# EasyEDA Pro project MFU.eprj, board HUB_ESP
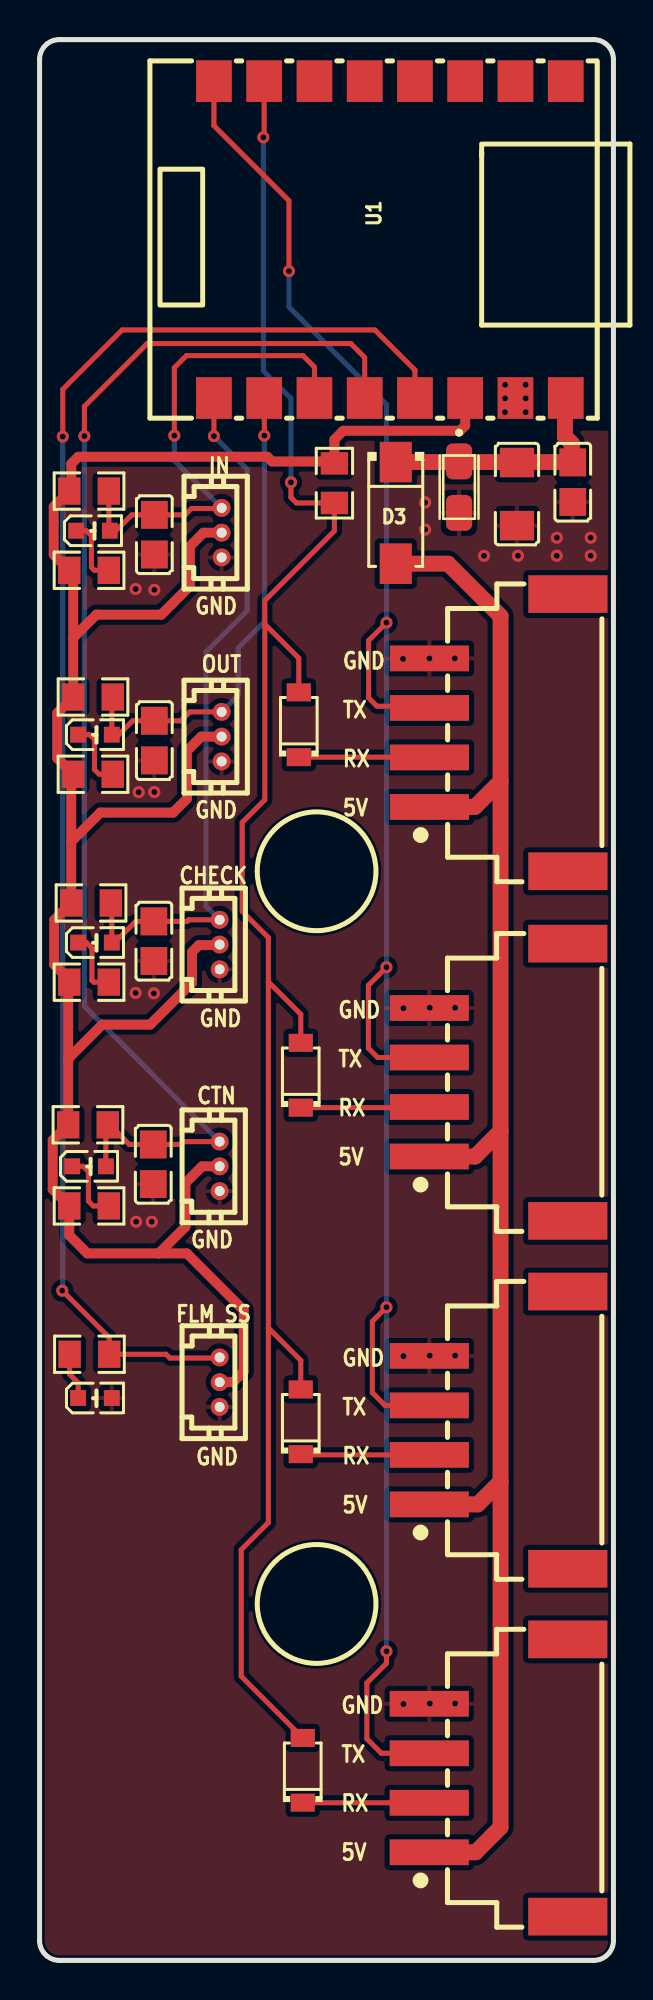
[diagram p7: board, top side]
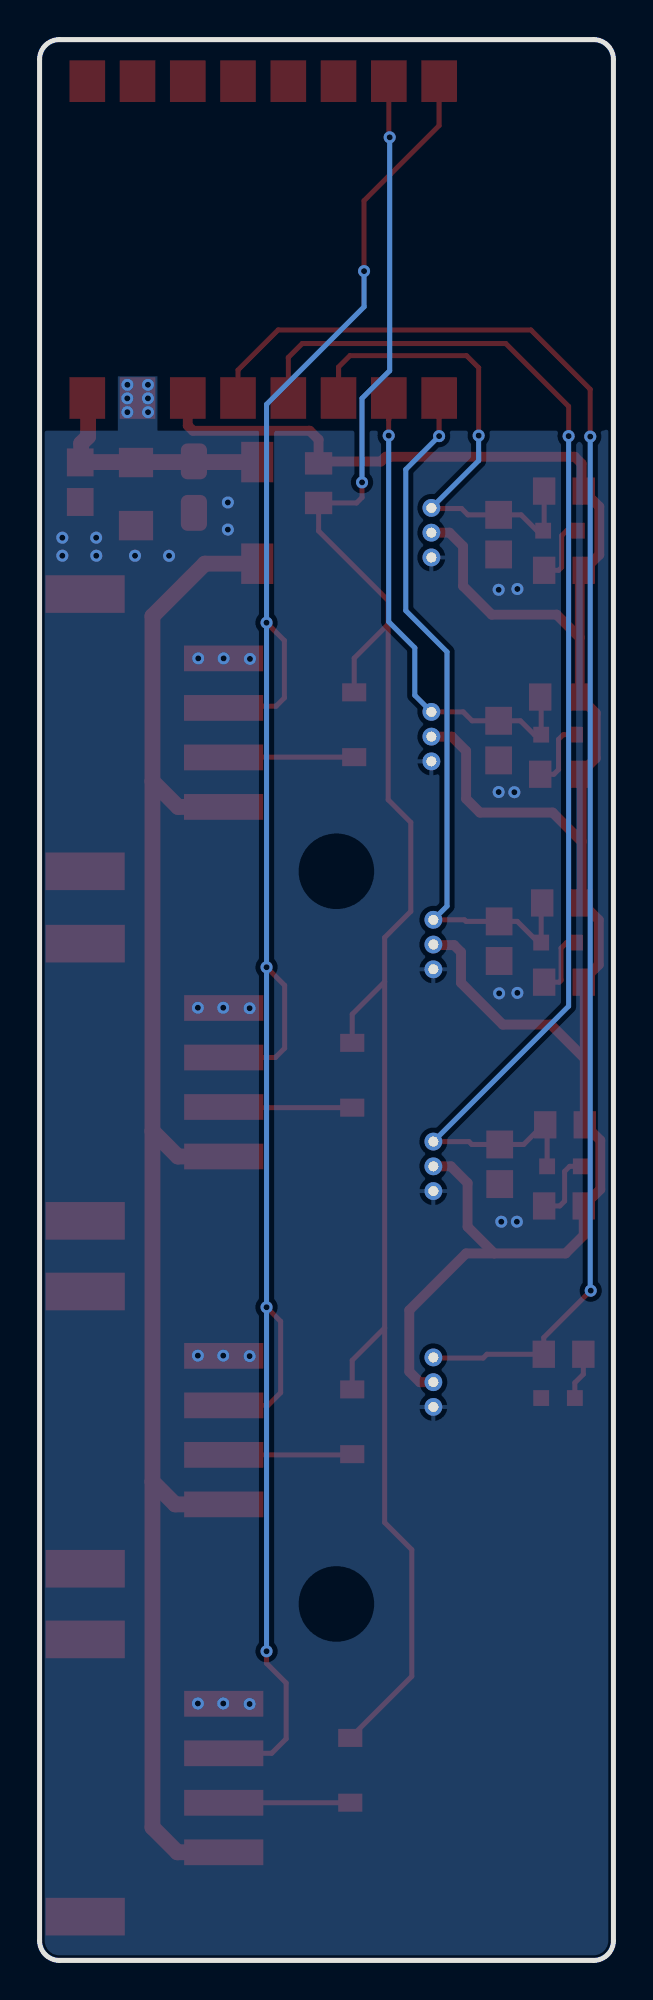
[diagram p8: board, bottom side, seen from below]

Outline 29 x 97 mm; copper layers: Top Layer, Bottom Layer. Coordinates in mm from the lower left corner of the outline.
Outline path: 0,96 arc(0.29,96.71) 1,97 28,97 arc(28.71,96.71) 29,96 29,1 arc(28.71,0.29) 28,0 1,0 arc(0.29,0.29) 0,1 0,96
Stack: Top Layer 0.035mm / Dielectric1 1.51mm FR4 er 4.5 / Bottom Layer 0.035mm

## Design rules (mm)
template: Custom Config
spacing copperThickness1oz (default): track to track 0.102, other pairs 0.152 to 0.3
spacing copperThickness2oz: track to track 0.203, other pairs 0.152 to 0.3
track width copperThickness1oz (default): min 0.127, default 0.254, max 2.54
track width copperThickness2oz: min 0.203, default 0.254, max 2.54
track width 5v: min 0.127, default 0.8, max 2.54
track width 3v3: min 0.127, default 0.5, max 2.54
differential pair differentialPair (default): width min 0.127, default 0.254, max 2.54; gap min 0.152, default 0.152
via viaSize (default): diameter min 0.5, default 0.61, max 10; hole min 0.3, default 0.305, max 6.3
net 3V3 uses 3v3
net GND uses 5v
net 5V uses 5v
net VCC uses 5v

## Placement (name value [footprint] x y rotation side)
C11  0.1u  [C0805]  26.94 74.65 270 top
C15  1u  [C1206]  24.13 74.05 270 top
C16  0.1u  [C0805]  5.8 61.6 270 top
C17  0.1u  [C0805]  5.8 72 270 top
C18  0.1u  [C0805]  5.78 51.47 270 top
C19  0.1u  [C0805]  5.75 40.2 270 top
CN2  XH2.54-4P  [CONN-SMD_4P-P2.50-WT]  23.19 44.35 90 top
CN3  XH2.54-4P  [CONN-SMD_4P-P2.50-WT]  23.19 26.78 90 top
CN4  XH2.54-4P  [CONN-SMD_4P-P2.50-WT]  23.19 9.21 90 top
CN5  XH2.54-4P  [CONN-SMD_4P-P2.50-WT]  23.2 62 90 top
D3  SS34  [SMA_L4.4-W2.8-LS5.4-RD]  18 73.1 270 top
D5  BAT54GWJ-HXY  [SOD-123_L2.7-W1.6-LS3.7-RD]  13.2 44.7 90 top
D6  BAT54GWJ-HXY  [SOD-123_L2.7-W1.6-LS3.7-RD]  13.2 27.2 90 top
D7  BAT54GWJ-HXY  [SOD-123_L2.7-W1.6-LS3.7-RD]  13.3 9.6 90 top
D8  BAT54GWJ-HXY  [SOD-123_L2.7-W1.6-LS3.7-RD]  13.1 62.4 90 top
LED2  -  [LED0603-R-RD]  2.8 61.9 0 top
LED3  -  [LED0603-R-RD]  2.7 72.2 0 top
LED4  -  [LED0603-R-RD]  2.8 51.4 0 top
LED5  -  [LED0603-R-RD]  2.5 40.1 0 top
LED6  -  [LED0603-R-RD]  2.8 28.4 0 top
R12  10k  [R0805]  2.7 59.9 180 top
R13  10k  [R0805]  2.7 63.8 180 top
R14  10k  [R0805]  2.5 70.2 180 top
R15  10k  [R0805]  2.5 74.2 180 top
R16  10k  [R0805]  2.5 49.4 180 top
R17  10k  [R0805]  2.6 53.4 180 top
R18  10k  [R0805]  14.9 74.6 90 top
R19  10k  [R0805]  2.5 38.1 180 top
R20  10k  [R0805]  2.45 42.2 180 top
R21  330  [R0805]  2.52 30.61 0 top
U1  ESP32C3-SuperMini  [COMM-SMD_16P-L22.5-W18.0-P2.54-TL]  17.7 86.9 270 top
U6  电池端子3pin  [CONN-TH_3P-P1.25_C9900015739]  9.2 72.1 270 top
U7  电池端子3pin  [CONN-TH_3P-P1.25_C9900015739]  9.2 61.8 270 top
U8  电池端子3pin  [CONN-TH_3P-P1.25_C9900015739]  9.1 51.3 270 top
U18  TAJA106M010RNJ  [CAPMP3216X180N]  21.2 74.4 270 top
U19  电池端子3pin  [CONN-TH_3P-P1.25_C9900015739]  9.1 40.1 270 top
U20  电池端子3pin  [CONN-TH_3P-P1.25_C9900015739]  9.1 29.2 270 top

## Footprints (pads in the part's own frame, mm; a bottom-side part is the same pattern mirrored in y, then rotated)
C0805
  rect 1.41x1.35 smd: 1(-1,0) 2(1,0)
C1206
  rect 1.485x1.728 smd: 1(-1.593,0) 2(1.593,0)
CAPMP3216X180N
  rrect 1.81x1.32 smd: 1(-1.3,0) 2(1.3,0)
COMM-SMD_16P-L22.5-W18.0-P2.54-TL
  rect 2.102x1.802 smd: 1(-8.001,8.89) 2(-8.001,6.35) 3(-8.001,3.81) 4(-8.001,1.27) 5(-8.001,-1.27) 6(-8.001,-3.81) 7(-8.001,-6.35) 8(-8.001,-8.89) 9(8.001,-8.89) 10(8.001,-6.35) 11(8.001,-3.81) 12(8.001,-1.27) 13(8.001,1.27) 14(8.001,3.81) 15(8.001,6.35) 16(8.001,8.89)
CONN-SMD_4P-P2.50-WT
  rect 1.3x4 smd: 1(-3.75,3.5) 2(-1.25,3.5) 3(1.25,3.5) 4(3.751,3.5)
  rect 1.9x4 smd: 5(7,-3.5) 6(-7,-3.5)
CONN-TH_3P-P1.25_C9900015739
  round 0.9 hole 0.5: 1(-1.25,0) 2(0,0) 3(1.25,0)
LED0603-R-RD
  rect 0.8x0.8 smd: 1(0.851,0) 2(-0.851,0)
R0805
  rect 1.133x1.377 smd: 1(-1,0) 2(1,0)
SMA_L4.4-W2.8-LS5.4-RD
  rect 2.046x1.62 smd: 1(-2.566,0) 2(2.566,0)
SOD-123_L2.7-W1.6-LS3.7-RD
  rect 0.91x1.22 smd: 1(-1.635,0) 2(1.635,0)

## Nets
As in the schematic.

Pads without a net: CN2 5 6; CN3 5 6; CN4 5 6; CN5 5 6; U1 1 2 3 4 5 6

## Via types
v1: diameter 0.61, hole 0.305, Top Layer to Bottom Layer, 47 vias

## Routing (per net, layer and track width the routed paths; a pad name or vN(x,y) marks a point on that pad's centre or on a via; arc(x,y) is an arc through that point)
3V3: length 119
  Top Layer w0.5: U1.14 21.51,77.51 21.25,77.25 15.35,77.25 14.9,76.8 R18.2 14.81,75.69 11.75,75.69 11.51,75.93 1.96,75.93 1.6,75.58 1.6,74.3 R15.2 0.72,73.42 0.72,70.98 R14.2 1.7,70 1.7,66.79 ; 6.02,35.7 7.45,35.7 10.32,32.83 10.32,29.73 9.78,29.2 U20.2 ; 6.02,35.7 2.42,35.7 1.5,36.62 R19.2 0.66,38.94 0.66,41.42 R20.2 1.45,45.54 ; 6.02,35.7 7.37,37.05 7.37,39.26 8.21,40.1 U19.2 ; U7.2 8.17,61.8 7.45,61.08 7.45,58.66 6.75,57.97 3.07,57.97 1.6,56.49 ; U8.2 9.07,51.27 8.06,51.27 7.7,50.92 7.7,49.37 5.59,47.26 3.17,47.26 1.45,45.54 ; 1.6,56.49 1.6,59.8 R12.2 0.89,60.71 0.89,62.99 R13.2 1.7,66.79 ; 1.6,56.49 R17.2 0.74,52.54 0.74,50.28 1.5,49.52 R16.2 1.45,49.35 1.45,45.54 ; U6.2 8.28,72.1 7.6,71.41 7.6,69.41 6.15,67.96 2.87,67.96 1.7,66.79
5V: length 84
  Top Layer w0.8: CN3.1 22.15,23.03 23.3,24.18 ; 23.3,24.18 23.3,41.88 ; 23.3,24.18 23.3,6.72 22.03,5.46 CN4.1 ; 23.3,41.88 22.01,40.6 CN2.1 ; 23.3,41.88 23.3,59.55 ; CN5.1 22,58.25 23.3,59.55 ; 23.3,59.55 23.3,67.88 20.65,70.53 D3.2
GND:
  vias: v1(4.85,69.26) v1(4.85,48.86) v1(4.88,37.3) v1(5.01,58.99) v1(5.67,37.3) v1(5.8,69.22) v1(5.8,59) v1(5.78,48.84) v1(18.37,65.72) v1(18.39,48.08) v1(18.39,30.52) v1(18.39,12.95) v1(19.49,73.62) v1(19.49,72.26) v1(19.7,65.75) v1(19.72,48.11) v1(19.72,30.54) v1(19.72,12.97) v1(20.98,65.75) v1(21,48.11) v1(21,30.54) v1(21,12.97) v1(22.46,70.93) v1(23.52,79.57) v1(23.52,78.88) v1(23.52,78.19) v1(24.18,70.94) v1(24.56,79.57) v1(24.57,78.88) v1(24.56,78.19) v1(26.14,71.85) v1(26.13,70.94) v1(27.85,71.85) v1(27.85,70.94)
VCC: length 12.4
  Top Layer w0.8: U1.16 26.55,78.86 26.55,76.95 26.9,76.6 26.9,75.69 26.93,75.67 ; D3.1 26.93,75.67 ; 26.93,75.67 C11.1
CHECK: length 36.1
  Top Layer w0.254: R17.1 3.65,53.35 LED4.1 3.79,51.4 4.86,52.47 C18.1 7.45,52.47 7.53,52.55 U8.1 ; U1.9 v1(8.81,76.98)
  Bottom Layer w0.254: v1(8.81,76.98) 10.49,75.29 10.49,68.16 8.41,66.08 8.41,53.24 U8.1
CTN: length 66
  Top Layer w0.254: LED5.1 3.35,42.1 R20.1 3.54,42.2 4.53,41.2 C19.1 7.16,41.2 7.3,41.35 U19.1 ; U1.12 16.43,80.95 15.73,81.65 5.44,81.65 2.26,78.48 v1(2.26,76.98)
  Bottom Layer w0.254: U19.1 2.26,48.19 v1(2.26,76.98)
FLM_SS: length 76.7
  Top Layer w0.254: U1.13 18.97,80.31 16.95,82.34 4.17,82.34 1.17,79.34 v1(1.17,76.95) ; v1(1.15,33.82) 3.52,31.45 R21.2 6.39,30.61 6.58,30.42 9.07,30.42 U20.1
  Bottom Layer w0.254: v1(1.15,33.82) 1.17,33.85 v1(1.17,76.95)
IN: length 25.4
  Top Layer w0.254: R15.1 3.5,72.25 LED3.1 3.86,72.2 4.66,73 C17.1 7.35,73 7.67,73.32 9.17,73.32 U6.1 ; v1(6.81,77) 6.81,80.43 7.42,81.04 13.31,81.04 13.89,80.46 U1.11
  Bottom Layer w0.254: v1(6.81,77) 6.81,75.74 U6.1
OUT: length 24.7
  Top Layer w0.254: R13.1 3.65,63.75 LED2.1 4,61.9 4.7,62.6 C16.1 7.14,62.6 7.59,63.05 U7.1 ; v1(11.36,77) 11.36,77 11.36,77.82 11.35,77.83 U1.10
  Bottom Layer w0.254: v1(11.36,77) 11.36,67.6 10.04,66.28 10.04,63.89 U7.1
RX: length 102.3
  Top Layer w0.254: D5.2 13.2,47.78 11.56,49.42 ; 11.56,49.42 11.56,51.65 10.24,52.97 10.24,57.47 11.38,58.61 11.38,67.48 ; 11.56,49.42 11.56,31.94 ; 11.56,31.94 13.2,30.3 13.2,28.84 ; 11.56,31.94 11.56,22.11 10.19,20.74 10.19,14.35 13.3,11.24 ; D8.2 13.1,65.76 11.38,67.48 ; 11.38,67.48 11.38,68.67 14.9,72.19 R18.1 12.98,73.6 12.7,73.88 v1(12.7,74.64) ; v1(11.31,92.06) 11.35,92.11 U1.7
  Bottom Layer w0.254: v1(11.31,92.06) 11.31,80.28 12.7,78.88 v1(12.7,74.64)
TX: length 114.1
  Top Layer w0.254: v1(17.53,50.16) 16.62,49.24 16.62,46.07 17.08,45.6 CN2.3 ; CN5.3 19.61,63.34 17.05,63.34 16.63,63.76 16.63,66.65 v1(17.53,67.55) ; CN3.3 17.46,28.03 16.82,28.67 16.82,32.27 v1(17.53,32.98) ; v1(12.6,85.31) 12.6,88.86 8.81,92.66 U1.8 ; v1(17.53,15.61) 17.53,15 16.54,14.01 16.54,11.19 17.27,10.46 CN4.3
  Bottom Layer w0.254: v1(17.53,15.61) v1(17.53,32.98) v1(17.53,50.16) v1(17.53,67.55) 17.53,78.58 12.6,83.5 v1(12.6,85.31)
$1N3011: length 3.5
  Top Layer w0.254: LED2.2 2.53,61.9 2.77,61.66 2.77,60.14 3.01,59.9 R12.1
$1N3239: length 3.4
  Top Layer w0.254: R14.1 2.77,70.2 2.62,70.35 2.62,71.95 2.37,72.2 LED3.2
$1N3371: length 3.3
  Top Layer w0.254: R16.1 2.74,49.4 2.65,49.49 2.65,51.12 2.37,51.4 LED4.2
$1N4208: length 6.5
  Top Layer w0.254: CN2.2 19.66,43.06 D5.1
$1N4347: length 6.5
  Top Layer w0.254: CN3.2 13.24,25.53 D6.1
$1N4480: length 6.4
  Top Layer w0.254: CN4.2 13.3,7.96 D7.1
$1N4613: length 6.6
  Top Layer w0.254: D8.1 19.69,60.77 CN5.2
$1N5147: length 3.6
  Top Layer w0.254: LED5.2 2.21,40.1 2.47,39.84 2.47,38.34 2.71,38.1 R19.1
$1N5311: length 2.4
  Top Layer w0.254: R21.1 1.52,29.6 1.95,29.17 LED6.2

## Copper pours and planes (outline as drawn; the poured copper is in the pictures)
GND on Top Layer: -3.17,100.4 32.21,100.4 32.21,-6.97 -3.17,-6.97
GND on Bottom Layer: -2.05,102.07 36.76,102.07 36.76,-3.24 -2.05,-3.24
GND on Bottom Layer: 23.04,80 25.04,80 25.04,75.99 23.04,75.99
(no net) on Top Layer: 17,55.17 16.96,55.5 16.88,55.83 16.77,56.15 16.63,56.45 16.45,56.74 16.24,57 16,57.24 15.74,57.45 15.45,57.63 15.15,57.77 14.83,57.88 14.5,57.96 14.17,58 13.83,58 13.5,57.96 13.17,57.88 12.85,57.77 12.55,57.63 12.26,57.45 12,57.24 11.76,57 11.55,56.74 11.37,56.45 11.23,56.15 11.12,55.83 11.04,55.5 11,55.17 11,54.83 11.04,54.5 11.12,54.17 11.23,53.85 11.37,53.55 11.55,53.26 11.76,53 12,52.76 12.26,52.55 12.55,52.37 12.85,52.23 13.17,52.12 13.5,52.04 13.83,52 14.17,52 14.5,52.04 14.83,52.12 15.15,52.23 15.45,52.37 15.74,52.55 16,52.76 16.24,53 16.45,53.26 16.63,53.55 16.77,53.85 16.88,54.17 16.96,54.5 17,54.83
(no net) on Top Layer: 17,18.17 16.96,18.5 16.88,18.83 16.77,19.15 16.63,19.45 16.45,19.74 16.24,20 16,20.24 15.74,20.45 15.45,20.63 15.15,20.77 14.83,20.88 14.5,20.96 14.17,21 13.83,21 13.5,20.96 13.17,20.88 12.85,20.77 12.55,20.63 12.26,20.45 12,20.24 11.76,20 11.55,19.74 11.37,19.45 11.23,19.15 11.12,18.83 11.04,18.5 11,18.17 11,17.83 11.04,17.5 11.12,17.17 11.23,16.85 11.37,16.55 11.55,16.26 11.76,16 12,15.76 12.26,15.55 12.55,15.37 12.85,15.23 13.17,15.12 13.5,15.04 13.83,15 14.17,15 14.5,15.04 14.83,15.12 15.15,15.23 15.45,15.37 15.74,15.55 16,15.76 16.24,16 16.45,16.26 16.63,16.55 16.77,16.85 16.88,17.17 16.96,17.5 17,17.83
(no net) on Top Layer: 0.51,96.36 28.76,96.36 28.76,77.51 0.51,77.51
(no net) on Bottom Layer: 0.54,96.38 28.76,96.38 28.76,77.51 0.54,77.51

## Text on the board
Top Silkscreen Layer: FLM SS | CHECK | GND | CTN | OUT | IN | TX | RX | 5V
